# Altium schematic sheet ESP32_S3_Wroom2_Schematic.SchDoc
size A3; DocumentNumber: 3; SheetNumber: 3; SheetTotal: 5
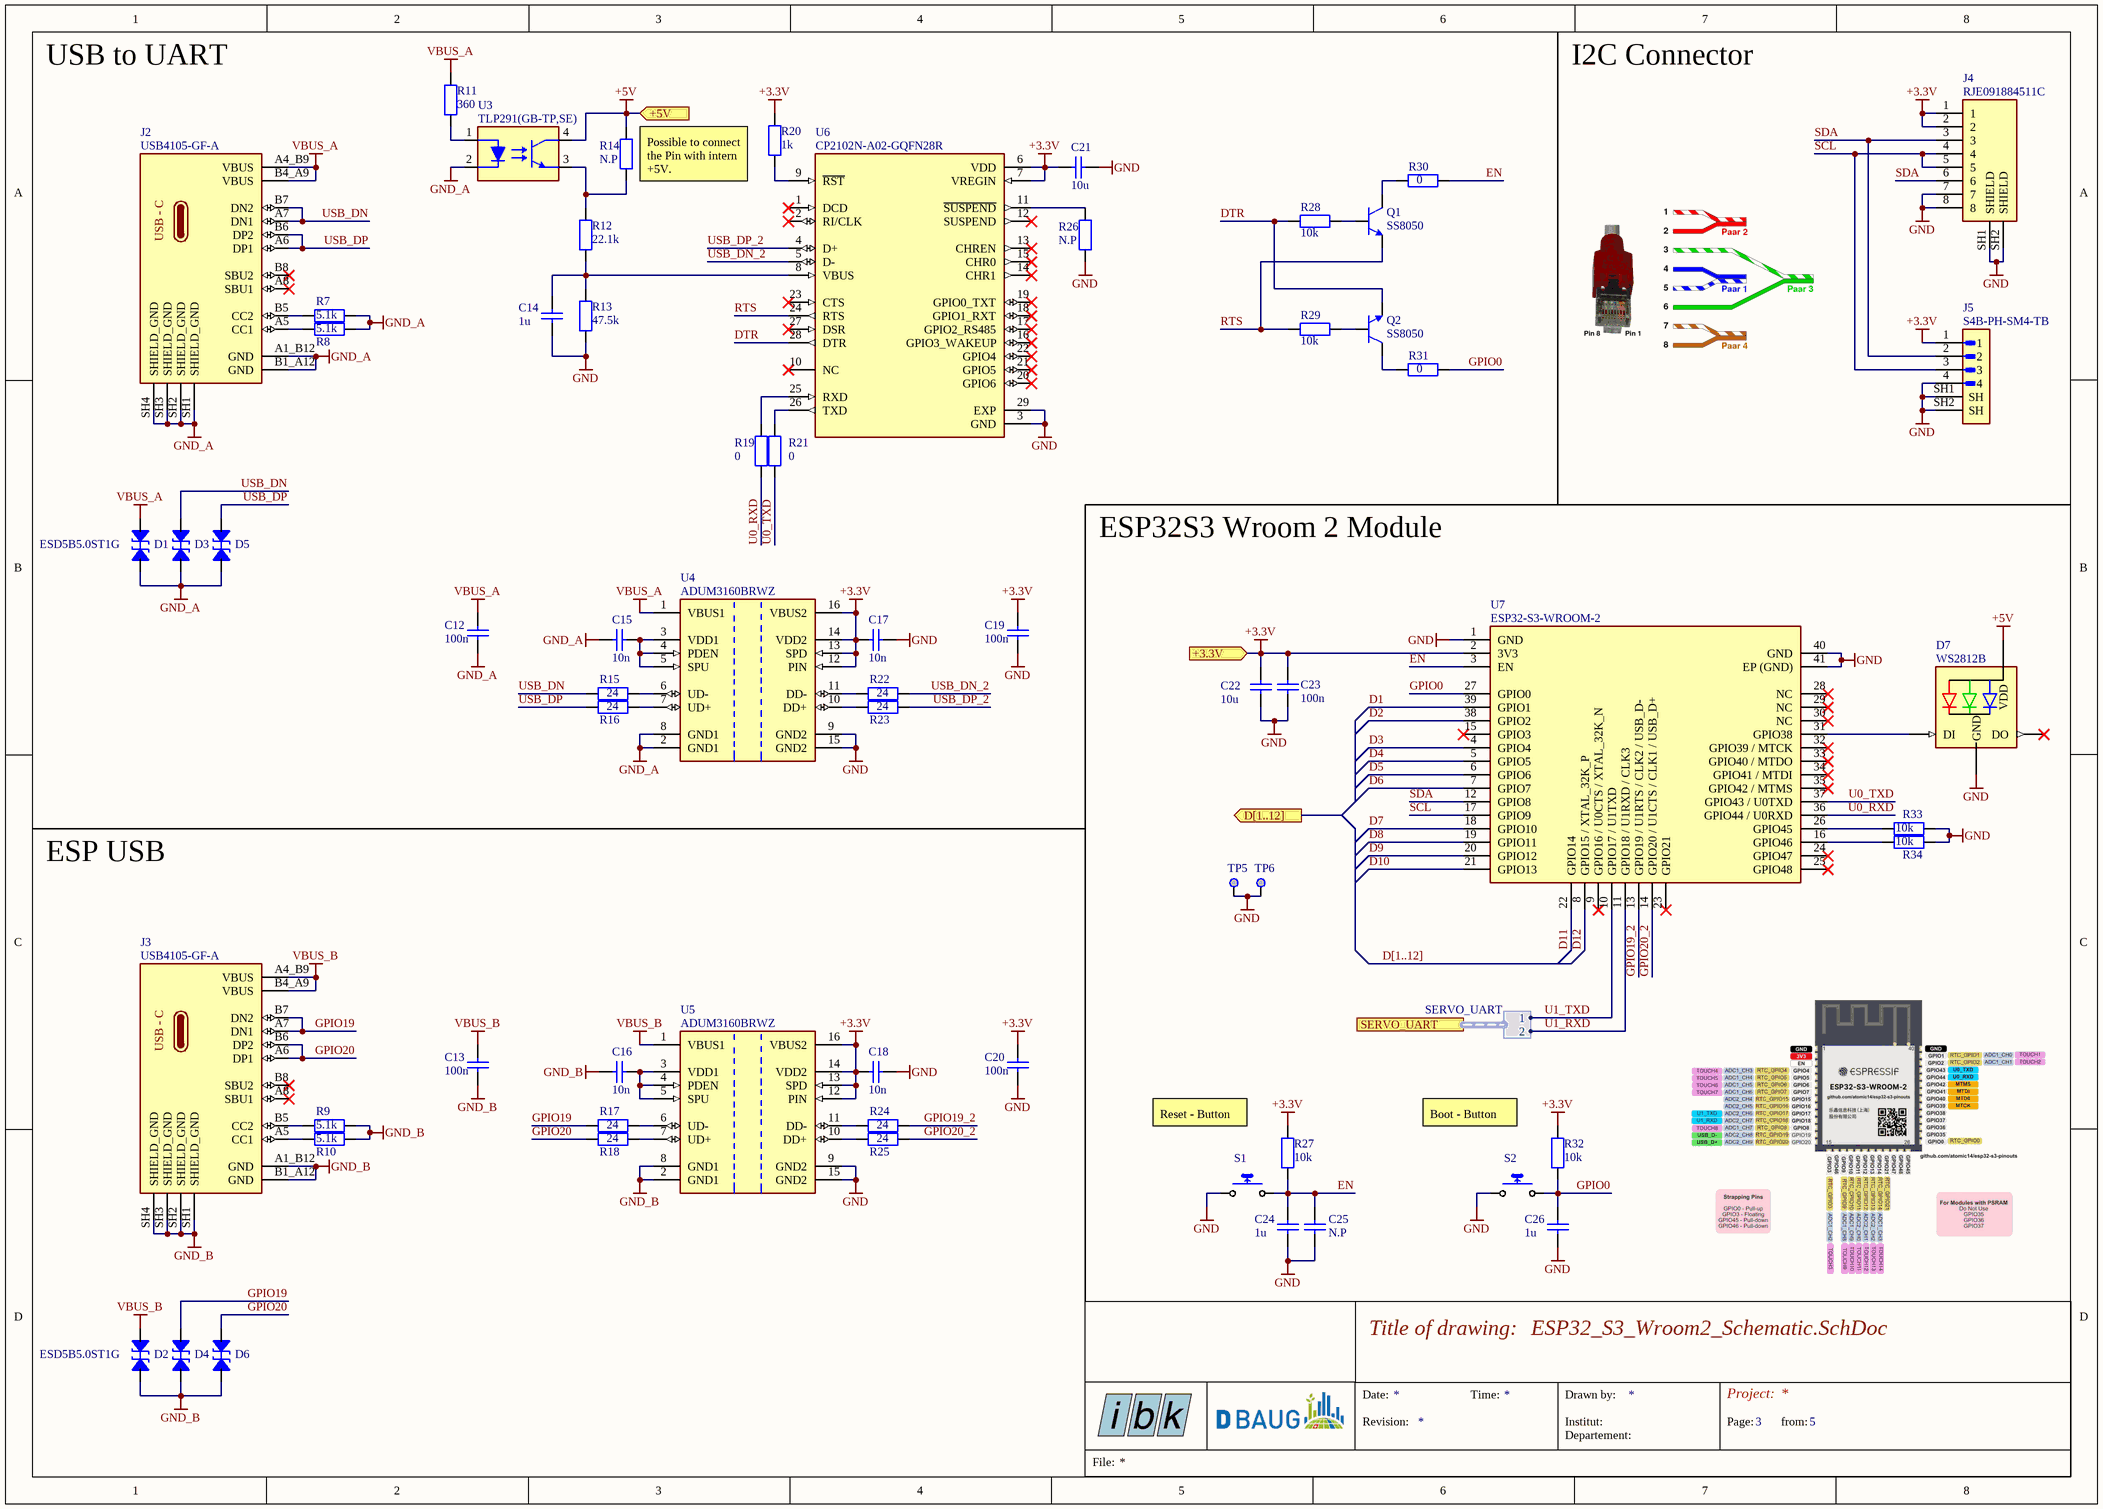
[diagram p0: ESP32_S3_Wroom2_Schematic.SchDoc]

## Parts
C12  100n  [0603_CAPACITOR]
C13  100n  [0603_CAPACITOR]
C14  1u  [0603_CAPACITOR]
C15  10n  [0603_CAPACITOR]
C16  10n  [0603_CAPACITOR]
C17  10n  [0603_CAPACITOR]
C18  10n  [0603_CAPACITOR]
C19  100n  [0603_CAPACITOR]
C20  100n  [0603_CAPACITOR]
C21  10u  [Capacitor_0805]
C22  10u  [Capacitor_0805]
C23  100n  [0603_CAPACITOR]
C24  1u  [0603_CAPACITOR]
C25  N.P  [Capacitor_1206]
C26  1u  [0603_CAPACITOR]
D1  ESD5B5.0ST1G  [ESD_Protecction_Diode]
D2  ESD5B5.0ST1G  [ESD_Protecction_Diode]
D3  ESD5B5.0ST1G  [ESD_Protecction_Diode]  (value not drawn)
D4  ESD5B5.0ST1G  [ESD_Protecction_Diode]  (value not drawn)
D5  ESD5B5.0ST1G  [ESD_Protecction_Diode]  (value not drawn)
D6  ESD5B5.0ST1G  [ESD_Protecction_Diode]  (value not drawn)
D7  WS2812B  [WS2812B]
J2  USB4105-GF-A  [USB4105-GF-A]
J3  USB4105-GF-A  [USB4105-GF-A]
J4  RJE091884511C  [RJ45]
J5  S4B-PH-SM4-TB  [Connector_SMD_Lying]
Q1  SS8050  [NPN_Bipolar_Transistor]
Q2  SS8050  [NPN_Bipolar_Transistor]
R7  5.1k  [Resistor_0603]
R8  5.1k  [Resistor_0603]
R9  5.1k  [Resistor_0603]
R10  5.1k  [Resistor_0603]
R11  360  [Resistor_0603]
R12  22.1k  [Resistor_0603]
R13  47.5k  [Resistor_0603]
R14  N.P  [1206_Resistor]
R15  24  [Resistor_0603]
R16  24  [Resistor_0603]
R17  24  [Resistor_0603]
R18  24  [Resistor_0603]
R19  0  [1206_Resistor]
R20  1k  [Resistor_0603]
R21  0  [1206_Resistor]
R22  24  [Resistor_0603]
R23  24  [Resistor_0603]
R24  24  [Resistor_0603]
R25  24  [Resistor_0603]
R26  N.P  [1206_Resistor]
R27  10k  [Resistor_0603]
R28  10k  [Resistor_0603]
R29  10k  [Resistor_0603]
R30  0  [1206_Resistor]
R31  0  [1206_Resistor]
R32  10k  [Resistor_0603]
R33  10k  [Resistor_0603]
R34  10k  [Resistor_0603]
S1  ?  [PTS636SK25SMTR]  (value not drawn)
S2  ?  [PTS636SK25SMTR]  (value not drawn)
TP5  Testpoint S2761-46R  [Testpoint S2761-46R]  (value not drawn)
TP6  Testpoint S2761-46R  [Testpoint S2761-46R]  (value not drawn)
U3  TLP291(GB-TP,SE)  [Optocoupler]
U4  ADUM3160BRWZ  [USB_Digital_Isolator_A]
U5  ADUM3160BRWZ  [USB_Digital_Isolator_A]
U6  CP2102N-A02-GQFN28R  [CP2102N-A02-GQFN28R]
U7  ESP32-S3-WROOM-2  [ESP32-S3-WROOM-2]

## Ports
+3.3V (in), +5V (in), D[1..12] (out), SERVO_UART (harness SERVO_UART)

## Harnesses
SERVO_UART: 1, 2

## Nets
+3.3V: C17.2 C18.2 C19.2 C20.2 C21.2 C22.1 C23.2 J4.1 J4.2 J5.1 R20.1 R27.2 R32.2 U4.12(PIN) U4.13(SPD) U4.14(VDD2) U4.16(VBUS2) U5.12(PIN) U5.13(SPD) U5.14(VDD2) U5.16(VBUS2) U6.6(VDD) U6.7(VREGIN) U7.2(3V3) ; port +3.3V
+5V: D7.1(VDD) R14.1 U3.4(COL) ; port +5V
GND: C14.1 C17.1 C18.1 C19.1 C20.1 C21.1 C22.2 C23.1 C24.1 C25.1 C26.1 D7.3(GND) J4.7 J4.8 J4.SH1(SHIELD) J4.SH2(SHIELD) J5.4 J5.SH1(SH) J5.SH2(SH) R13.2 R26.2 R33.1 R34.1 S1.1 S2.1 TP5.1 TP6.1 U4.9(GND2) U4.15(GND2) U5.9(GND2) U5.15(GND2) U6.3(GND) U6.29(EXP) U7.1(GND) U7.40(GND) U7.41(EP_(GND))
GND_A: C12.1 C15.2 D1.A(P$1) D3.A(P$1) D5.A(P$1) J2.A1_B12(GND) J2.B1_A12(GND) J2.SH1(SHIELD_GND) J2.SH2(SHIELD_GND) J2.SH3(SHIELD_GND) J2.SH4(SHIELD_GND) R7.1 R8.1 U3.2(C) U4.2(GND1) U4.8(GND1)
GND_B: C13.1 C16.2 D2.A(P$1) D4.A(P$1) D6.A(P$1) J3.A1_B12(GND) J3.B1_A12(GND) J3.SH1(SHIELD_GND) J3.SH2(SHIELD_GND) J3.SH3(SHIELD_GND) J3.SH4(SHIELD_GND) R9.1 R10.1 U5.2(GND1) U5.8(GND1)
VBUS_A: C12.2 D1.K(P$2) J2.A4_B9(VBUS) J2.B4_A9(VBUS) R11.1 U4.1(VBUS1)
VBUS_B: C13.2 D2.K(P$2) J3.A4_B9(VBUS) J3.B4_A9(VBUS) U5.1(VBUS1)
D1: U7.39(GPIO1)
D2: U7.38(GPIO2)
D3: U7.4(GPIO4)
D4: U7.5(GPIO5)
D5: U7.6(GPIO6)
D6: U7.7(GPIO7)
D7: U7.18(GPIO10)
D8: U7.19(GPIO11)
D9: U7.20(GPIO12)
D10: U7.21(GPIO13)
D11: U7.22(GPIO14)
D12: U7.8(GPIO15_/_XTAL_32K_P)
DTR: Q2.2(E) R28.2 U6.28(DTR)
EN: C24.2 C25.2 R27.1 R30.2 S1.2 U7.3(EN)
GPIO0: C26.2 R31.2 R32.1 S2.2 U7.27(GPIO0)
GPIO19: D4.K(P$2) J3.A7(DN1) J3.B7(DN2) R17.2
GPIO19_2: R24.1 U7.13(GPIO19_/_U1RTS_/_CLK2_/_USB_D-)
GPIO20: D6.K(P$2) J3.A6(DP1) J3.B6(DP2) R18.2
GPIO20_2: R25.1 U7.14(GPIO20_/_U1CTS_/_CLK1_/_USB_D+)
RTS: Q1.2(E) R29.2 U6.24(RTS)
SCL: J4.4 J4.5 J5.3 U7.17(GPIO9)
SDA: J4.3 J4.6 J5.2 U7.12(GPIO8)
U0_RXD: R19.1 U7.36(GPIO44_/_U0RXD)
U0_TXD: R21.1 U7.37(GPIO43_/_U0TXD)
U1_RXD: U7.11(GPIO18_/_U1RXD_/_CLK3) ; port SERVO_UART.2
U1_TXD: U7.10(GPIO17_/_U1TXD) ; port SERVO_UART.1
USB_DN: D3.K(P$2) J2.A7(DN1) J2.B7(DN2) R15.2
USB_DN_2: R22.1 U6.5(D-)
USB_DP: D5.K(P$2) J2.A6(DP1) J2.B6(DP2) R16.2
USB_DP_2: R23.1 U6.4(D+)
NetC14_2: C14.2 R12.2 R13.1 U6.8(VBUS)
NetC15_1: C15.1 U4.3(VDD1) U4.4(PDEN) U4.5(SPU)
NetC16_1: C16.1 U5.3(VDD1) U5.4(PDEN) U5.5(SPU)
NetD7_4: D7.4(DI) U7.31(GPIO38)
NetJ2_A5: J2.A5(CC1) R8.2
NetJ2_B5: J2.B5(CC2) R7.2
NetJ3_A5: J3.A5(CC1) R10.2
NetJ3_B5: J3.B5(CC2) R9.2
NetQ1_1: Q1.1(B) R28.1
NetQ1_3: Q1.3(C) R30.1
NetQ2_1: Q2.1(B) R29.1
NetQ2_3: Q2.3(C) R31.1
NetR11_2: R11.2 U3.1(A)
NetR12_1: R12.1 R14.2 U3.3(EMIT)
NetR15_1: R15.1 U4.6(UD-)
NetR16_1: R16.1 U4.7(UD+)
NetR17_1: R17.1 U5.6(UD-)
NetR18_1: R18.1 U5.7(UD+)
NetR19_2: R19.2 U6.25(RXD)
NetR20_2: R20.2 U6.9(~{RST})
NetR21_2: R21.2 U6.26(TXD)
NetR22_2: R22.2 U4.11(DD-)
NetR23_2: R23.2 U4.10(DD+)
NetR24_2: R24.2 U5.11(DD-)
NetR25_2: R25.2 U5.10(DD+)
NetR26_1: R26.1 U6.11(~{SUSPEND})
NetR33_2: R33.2 U7.26(GPIO45)
NetR34_2: R34.2 U7.16(GPIO46)

Not connected (* = marked no-connect by the designer): D7 2(DO)*; J2 A8(SBU1)* B8(SBU2)*; J3 A8(SBU1)* B8(SBU2)*; U6 1(DCD)* 2(RI/CLK)* 10(NC)* 12(SUSPEND)* 13(CHREN)* 14(CHR1)* 15(CHR0)* 16(GPIO3_WAKEUP)* 17(GPIO2_RS485)* 18(GPIO1_RXT)* 19(GPIO0_TXT)* 20(GPIO6)* 21(GPIO5)* 22(GPIO4)* 23(CTS)* 27(DSR)*; U7 9(GPIO16_/_U0CTS_/_XTAL_32K_N)* 15(GPIO3)* 23(GPIO21)* 24(GPIO47)* 25(GPIO48)* 28(NC)* 29(NC)* 30(NC)* 32(GPIO39_/_MTCK)* 33(GPIO40_/_MTDO)* 34(GPIO41_/_MTDI)* 35(GPIO42_/_MTMS)*

## Buses and harness runs
bus D[1..12] = port D[1..12]

## Notes on the sheet
- USB to UART
- I2C Connector
- (near R14) Possible to connect the Pin with intern +5V.
- ESP32S3 Wroom 2 Module
- ESP USB
- (near R27) Reset - Button
- (near R32) Boot - Button
- Date:
- Title of drawing:
- Time:
- Drawn by:
- Project:
- Revision:
- Institut:
- Departement:
- Page:
- from:
- File:
- (in symbol USB4105-GF-A) USB - C

## Library data of the parts
C12-C20 C23 C24 C26 = Capacitor_0603: 0603
C21 C22 = Capacitor_0805: 0805
C25 = Capacitor_1206: 1206
D1-D6 = ESD_Protection_Diode: ComponentLink1Description: Supplier; ComponentLink1URL: https://www.digikey.com/en/products/detail/onsemi/ESD5B5-0ST1G/1792206
J2 J3 = USB4105-GF-A: USB - C - Port
J4 = RJ45: Jack Modular Connector 8p8c (RJ45, Ethernet) 90Â° Angle (Right) Shielded Cat3.; MF: Amphenol ICC (Commercial Products); SnapEDA_Link: https://www.snapeda.com/parts/RJE091884511C/Amphenol/view-part/?ref=snap; Package: None; System: Connector; MP: RJE091884511C; Check_prices: https://www.snapeda.com/parts/RJE091884511C/Amphenol/view-part/?ref=eda; Parameter 1: *
J5 = Connector_SMD_Lying_Small_Symbol: Connector Header Surface Mount, Right Angle 4 position 0.079 (2.00mm).; ComponentLink1Description: Supplier; ComponentLink1URL: https://www.digikey.ch/de/products/detail/jst-sales-america-inc/S4B-PH-SM4-TB/926657?s=N4IgTCBcDaIMoBYBCBaACgCRXAsglAKkiALoC%2BQA
Q1 Q2 = NPN_Bipolar_Transistor: SS8050 SOT - 23.; ComponentLink1Description: Supplier; ComponentLink1URL: https://www.digikey.com/en/products/detail/guangdong-inmark-electronics-co-ltd/SS8050/28539054
R7-R13 R15-R18 R20 R22-R25 R27-R29 R32-R34 = Resistor_0603: 0603
R14 R19 R21 R26 R30 R31 = Resistor_1206: 1206
S1 S2 = Button
TP5 TP6 = Testpoint S2761-46R: Prüfstecker und Messbuchsen EZ BoardWare S27 SMT Mini Test Terminal, Reel
U3 = Optocoupler: Optoisolator Transistor Output 3750Vrms 1 Channel 4-SO.
U4 U5 = USB_Digital_Isolator: DGT ISOL 2500VRMS 2CH USB 16SOIC.
U6 = CP2102N-A02-GQFN28R: USB to UART bridge.; ComponentLink1Description: Datasheet; ComponentLink1URL: chrome-extension://efaidnbmnnnibpcajpcglclefindmkaj/https://www.silabs.com/documents/public/data-sheets/cp2102n-datasheet.pdf; ComponentLink2Description: Supplierlink; ComponentLink2URL: https://www.digikey.ch/en/products/detail/silicon-laboratories-inc/CP2102N-A02-GQFN28R/9863486?utm_source=findchips&utm_medium=aggregator&utm_campaign=buynow
U7 = ESP32-S3-WROOM-2-N32R16V: Bluetooth, WiFi 802.11b/g/n, Bluetooth v5.0 Transceiver Module 2.4GHz PCB Trace Surface Mount; Manufacturer: Espressif Systems; Latest Revision Made By: Simon Gimple; Latest Revision Note: New Part; Assembly Technology: SMD; Latest Revision Date: 17.10.2025; Manufacturer Part Number: ESP32-S3-WROOM-2-N32R16V; Note Schematic: *; SMS-Lab Part Number: *; Supplier 1: DigiKey; Supplier 2: Mouser; Supplier 3: *; Supplier 1 Part Number: 1965-ESP32-S3-WROOM-2-N32R16VCT-ND; Supplier 2 Part Number: 356-SP32S3WM2N32R16V; Supplier 3 Part Number: *; Value: *; ComponentLink1Description: Show Datasheet on SMS Drive; ComponentLink1URL: P:\Electronic Workshop\Datasheets (Refered in Libraries - Don't Change!)\ESP32-S3-WROOM-2-N32R16V_Digikey_1965-ESP32-S3-WROOM-2-N32R16VCT-ND.pdf